# Altium project ROV_Voltage_Switch_1.1.PrjPcb (part 2 of 2)

## Sheet [4]Misc_Parts.SchDoc
size A3
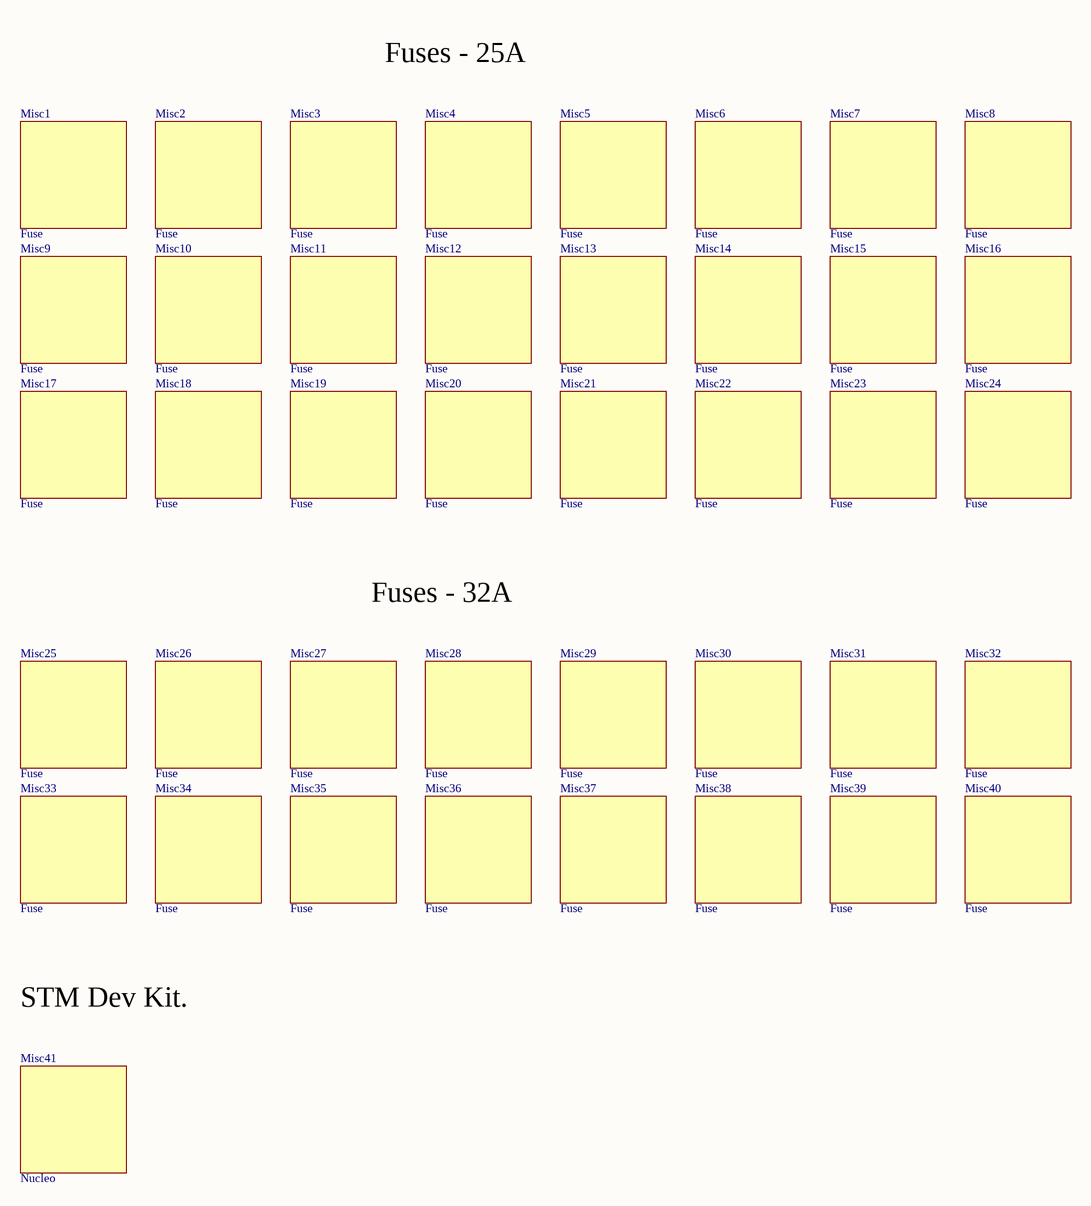
[diagram p9: [4]Misc_Parts.SchDoc]

### Parts
Misc1  Fuse  (mechanical)
Misc2  Fuse  (mechanical)
Misc3  Fuse  (mechanical)
Misc4  Fuse  (mechanical)
Misc5  Fuse  (mechanical)
Misc6  Fuse  (mechanical)
Misc7  Fuse  (mechanical)
Misc8  Fuse  (mechanical)
Misc9  Fuse  (mechanical)
Misc10  Fuse  (mechanical)
Misc11  Fuse  (mechanical)
Misc12  Fuse  (mechanical)
Misc13  Fuse  (mechanical)
Misc14  Fuse  (mechanical)
Misc15  Fuse  (mechanical)
Misc16  Fuse  (mechanical)
Misc17  Fuse  (mechanical)
Misc18  Fuse  (mechanical)
Misc19  Fuse  (mechanical)
Misc20  Fuse  (mechanical)
Misc21  Fuse  (mechanical)
Misc22  Fuse  (mechanical)
Misc23  Fuse  (mechanical)
Misc24  Fuse  (mechanical)
Misc25  Fuse  (mechanical)
Misc26  Fuse  (mechanical)
Misc27  Fuse  (mechanical)
Misc28  Fuse  (mechanical)
Misc29  Fuse  (mechanical)
Misc30  Fuse  (mechanical)
Misc31  Fuse  (mechanical)
Misc32  Fuse  (mechanical)
Misc33  Fuse  (mechanical)
Misc34  Fuse  (mechanical)
Misc35  Fuse  (mechanical)
Misc36  Fuse  (mechanical)
Misc37  Fuse  (mechanical)
Misc38  Fuse  (mechanical)
Misc39  Fuse  (mechanical)
Misc40  Fuse  (mechanical)
Misc41  Nucleo  (mechanical)

### Notes on the sheet
- Fuses - 25A
- Fuses - 32A
- STM Dev Kit.

### Library data of the parts
Misc1-Misc24 = Empty Component: Manufacturer Part No.: 8020.5025; Manufacturer Name: Schurter; Distributor Link: https://www.mouser.co.uk/ProductDetail/Schurter/80205025?qs=sGAEpiMZZMsIz3CjQ1xegWCT6TrQpP45zKPj%2FqTQoTr48FM%2FPi2y3g%3D%3D
Misc25-Misc40 = Empty Component: Manufacturer Part No.: 8020.5026; Manufacturer Name: Schurter; Distributor Link: https://www.digikey.com/product-detail/en/schurter-inc/8020.5026/486-3295-ND/6568978
Misc41 = Empty Component: Manufacturer Part No.: NUCLEO-F030R8; Manufacturer Name: STMicroelectronics; Distributor Link: https://eu.mouser.com/ProductDetail/STMicroelectronics/NUCLEO-F030R8?qs=fK8dlpkaUMvL9GSuoYnNYw%3D%3D

## Nets that join several sheets
+3V3: [1]High_Power (L1.1 R9.2 R11.1), [2]Analog (R35.2), [3]Digital (23 pins)
+5V: [1]High_Power (R12.1), Power_1/MOC_CH_1 (1R60.2 1R61.2), Power_1/MOC_CH_2 (2R60.2 2R61.2), Power_1/MOC_CH_3 (3R60.2 3R61.2), Power_1/MOC_CH_4 (4R60.2 4R61.2), Power_1/MOC_CH_5 (5R60.2 5R61.2), Power_1/MOC_CH_6 (6R60.2 6R61.2), Power_1/MOC_CH_7 (7R60.2 7R61.2), Power_1/MOC_CH_8 (8R60.2 8R61.2), [2]Analog (C4.2 L2.1 R29.2), [3]Digital (13 pins)
GND: [1]High_Power (C1.1 OPT1.4 R10.1 U1.5), Power_1/MOC_CH_1 (1Q19.2 1R62.1), Power_1/MOC_CH_2 (2Q19.2 2R62.1), Power_1/MOC_CH_3 (3Q19.2 3R62.1), Power_1/MOC_CH_4 (4Q19.2 4R62.1), Power_1/MOC_CH_5 (5Q19.2 5R62.1), Power_1/MOC_CH_6 (6Q19.2 6R62.1), Power_1/MOC_CH_7 (7Q19.2 7R62.1), Power_1/MOC_CH_8 (8Q19.2 8R62.1), [2]Analog (C4.1 Q12.2 R17.2), [3]Digital (74 pins)
CHANEL_CONTROL_1: Power_1/MOC_CH_1 (1P27.1 1P27.2 1Q19.1 1R62.2), [3]Digital (U6.15)
CHANEL_CONTROL_2: Power_1/MOC_CH_2 (2P27.1 2P27.2 2Q19.1 2R62.2), [3]Digital (U6.14)
CHANEL_CONTROL_3: Power_1/MOC_CH_3 (3P27.1 3P27.2 3Q19.1 3R62.2), [3]Digital (U6.13)
CHANEL_CONTROL_4: Power_1/MOC_CH_4 (4P27.1 4P27.2 4Q19.1 4R62.2), [3]Digital (U6.12)
CHANEL_CONTROL_5: Power_1/MOC_CH_5 (5P27.1 5P27.2 5Q19.1 5R62.2), [3]Digital (U6.11)
CHANEL_CONTROL_6: Power_1/MOC_CH_6 (6P27.1 6P27.2 6Q19.1 6R62.2), [3]Digital (U6.10)
CHANEL_CONTROL_7: Power_1/MOC_CH_7 (7P27.1 7P27.2 7Q19.1 7R62.2), [3]Digital (U6.9)
CHANEL_CONTROL_8: Power_1/MOC_CH_8 (8P27.1 8P27.2 8Q19.1 8R62.2), [3]Digital (U6.7)
Net1MOC1_4: [1]High_Power (Q1.3), Power_1/MOC_CH_1 (1MOC1.4)
Net1MOC1_6: [1]High_Power (R1.1), Power_1/MOC_CH_1 (1MOC1.6)
Net2MOC1_4: [1]High_Power (Q2.3), Power_1/MOC_CH_2 (2MOC1.4)
Net2MOC1_6: [1]High_Power (R2.1), Power_1/MOC_CH_2 (2MOC1.6)
Net3MOC1_4: [1]High_Power (Q3.3), Power_1/MOC_CH_3 (3MOC1.4)
Net3MOC1_6: [1]High_Power (R3.1), Power_1/MOC_CH_3 (3MOC1.6)
Net4MOC1_4: [1]High_Power (Q4.3), Power_1/MOC_CH_4 (4MOC1.4)
Net4MOC1_6: [1]High_Power (R4.1), Power_1/MOC_CH_4 (4MOC1.6)
Net5MOC1_4: [1]High_Power (Q5.3), Power_1/MOC_CH_5 (5MOC1.4)
Net5MOC1_6: [1]High_Power (R5.1), Power_1/MOC_CH_5 (5MOC1.6)
Net6MOC1_4: [1]High_Power (Q6.3), Power_1/MOC_CH_6 (6MOC1.4)
Net6MOC1_6: [1]High_Power (R6.1), Power_1/MOC_CH_6 (6MOC1.6)
Net7MOC1_4: [1]High_Power (Q7.3), Power_1/MOC_CH_7 (7MOC1.4)
Net7MOC1_6: [1]High_Power (R7.1), Power_1/MOC_CH_7 (7MOC1.6)
Net8MOC1_4: [1]High_Power (Q8.3), Power_1/MOC_CH_8 (8MOC1.4)
Net8MOC1_6: [1]High_Power (R8.1), Power_1/MOC_CH_8 (8MOC1.6)
NetOPT1_5: [1]High_Power (5 pins), [3]Digital (U7.15)
NetP9_1: [2]Analog (P9.1 P9.2 R23.2 R26.1), [3]Digital (U7.14)
NetP17_1: [2]Analog (P17.1 P17.2 Q12.1), [3]Digital (U7.16)
VIOUT: [1]High_Power (U1.7), [2]Analog (P10.3 R19.1)
VIOUT_NEG_PEAK: [2]Analog (P16.1 P16.2 R32.2 R33.1), [3]Digital (U7.11)
VIOUT_POS_PEAK: [2]Analog (P13.1 P13.2 R28.2 R30.1), [3]Digital (U7.10)